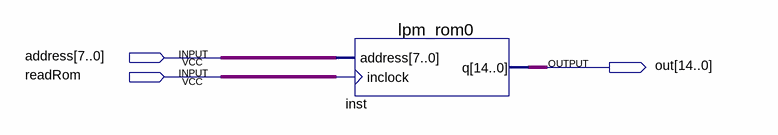
[diagram p0: schematic sheet]
// Quartus schematic ROM.bdf as structural Verilog: 1 symbols, 3 pins
module ROM (
  input  [7:0] address,
  input  readRom,
  output [14:0] out
);

  lpm_rom0 inst (.address(address), .inclock(readRom), .q(out));
endmodule
